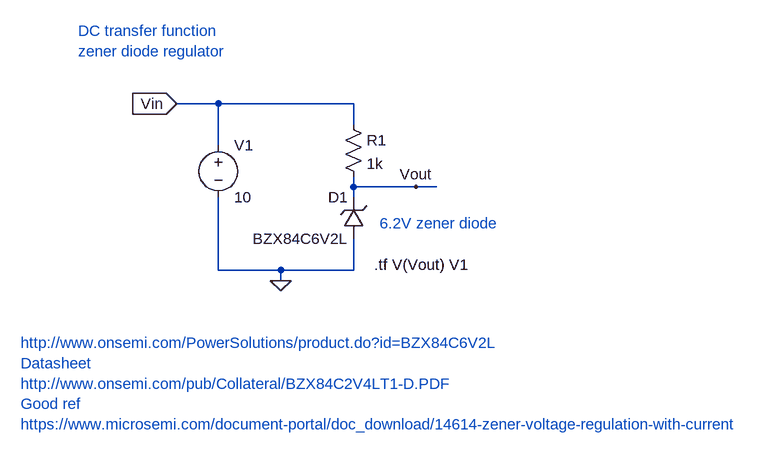
[diagram p0: schematic LTspice 03-4 tf3 zener diode_regulator.asc]
LTspice 03-4 tf3 zener diode_regulator.asc, the LTspice schematic file:
Version 4
SHEET 1 1512 680
WIRE 544 160 480 160
WIRE 752 160 544 160
WIRE 752 192 752 160
WIRE 544 224 544 160
WIRE 752 288 752 272
WIRE 848 288 752 288
WIRE 880 288 848 288
WIRE 752 304 752 288
WIRE 544 416 544 304
WIRE 640 416 544 416
WIRE 752 416 752 368
WIRE 752 416 640 416
WIRE 640 432 640 416
FLAG 640 432 0
FLAG 480 160 Vin
IOPIN 480 160 In
FLAG 848 288 Vout
SYMBOL zener 768 368 R180
WINDOW 0 24 64 Left 2
WINDOW 3 24 0 Left 2
SYMATTR InstName D1
SYMATTR Value BZX84C6V2L
SYMATTR Description Diode
SYMATTR Type diode
SYMBOL res 736 176 R0
SYMATTR InstName R1
SYMATTR Value 1k
SYMBOL voltage 544 208 R0
WINDOW 123 0 0 Left 2
WINDOW 39 0 0 Left 2
SYMATTR InstName V1
SYMATTR Value 10
TEXT 784 408 Left 2 !.tf V(Vout) V1
TEXT 328 48 Left 2 ;DC transfer function\nzener diode regulator
TEXT 792 344 Left 2 ;6.2V zener diode
TEXT 240 528 Left 2 ;http://www.onsemi.com/PowerSolutions/product.do?id=BZX84C6V2L\nDatasheet\nhttp://www.onsemi.com/pub/Collateral/BZX84C2V4LT1-D.PDF\nGood ref\nhttps://www.microsemi.com/document-portal/doc_download/14614-zener-voltage-regulation-with-current

The netlist it stands for:
* LTspice 03-4 tf3 zener diode_regulator.asc
D1 0 Vout BZX84C6V2L
R1 Vin Vout 1k
V1 Vin 0 10
.model D D
.lib standard.dio
.tf V(Vout) V1
* DC transfer function
* zener diode regulator
* 6.2V zener diode
* http://www.onsemi.com/PowerSolutions/product.do?id=BZX84C6V2L
* Datasheet
* http://www.onsemi.com/pub/Collateral/BZX84C2V4LT1-D.PDF
* Good ref
* https://www.microsemi.com/document-portal/doc_download/14614-zener-voltage-regulation-with-current
.backanno
.end